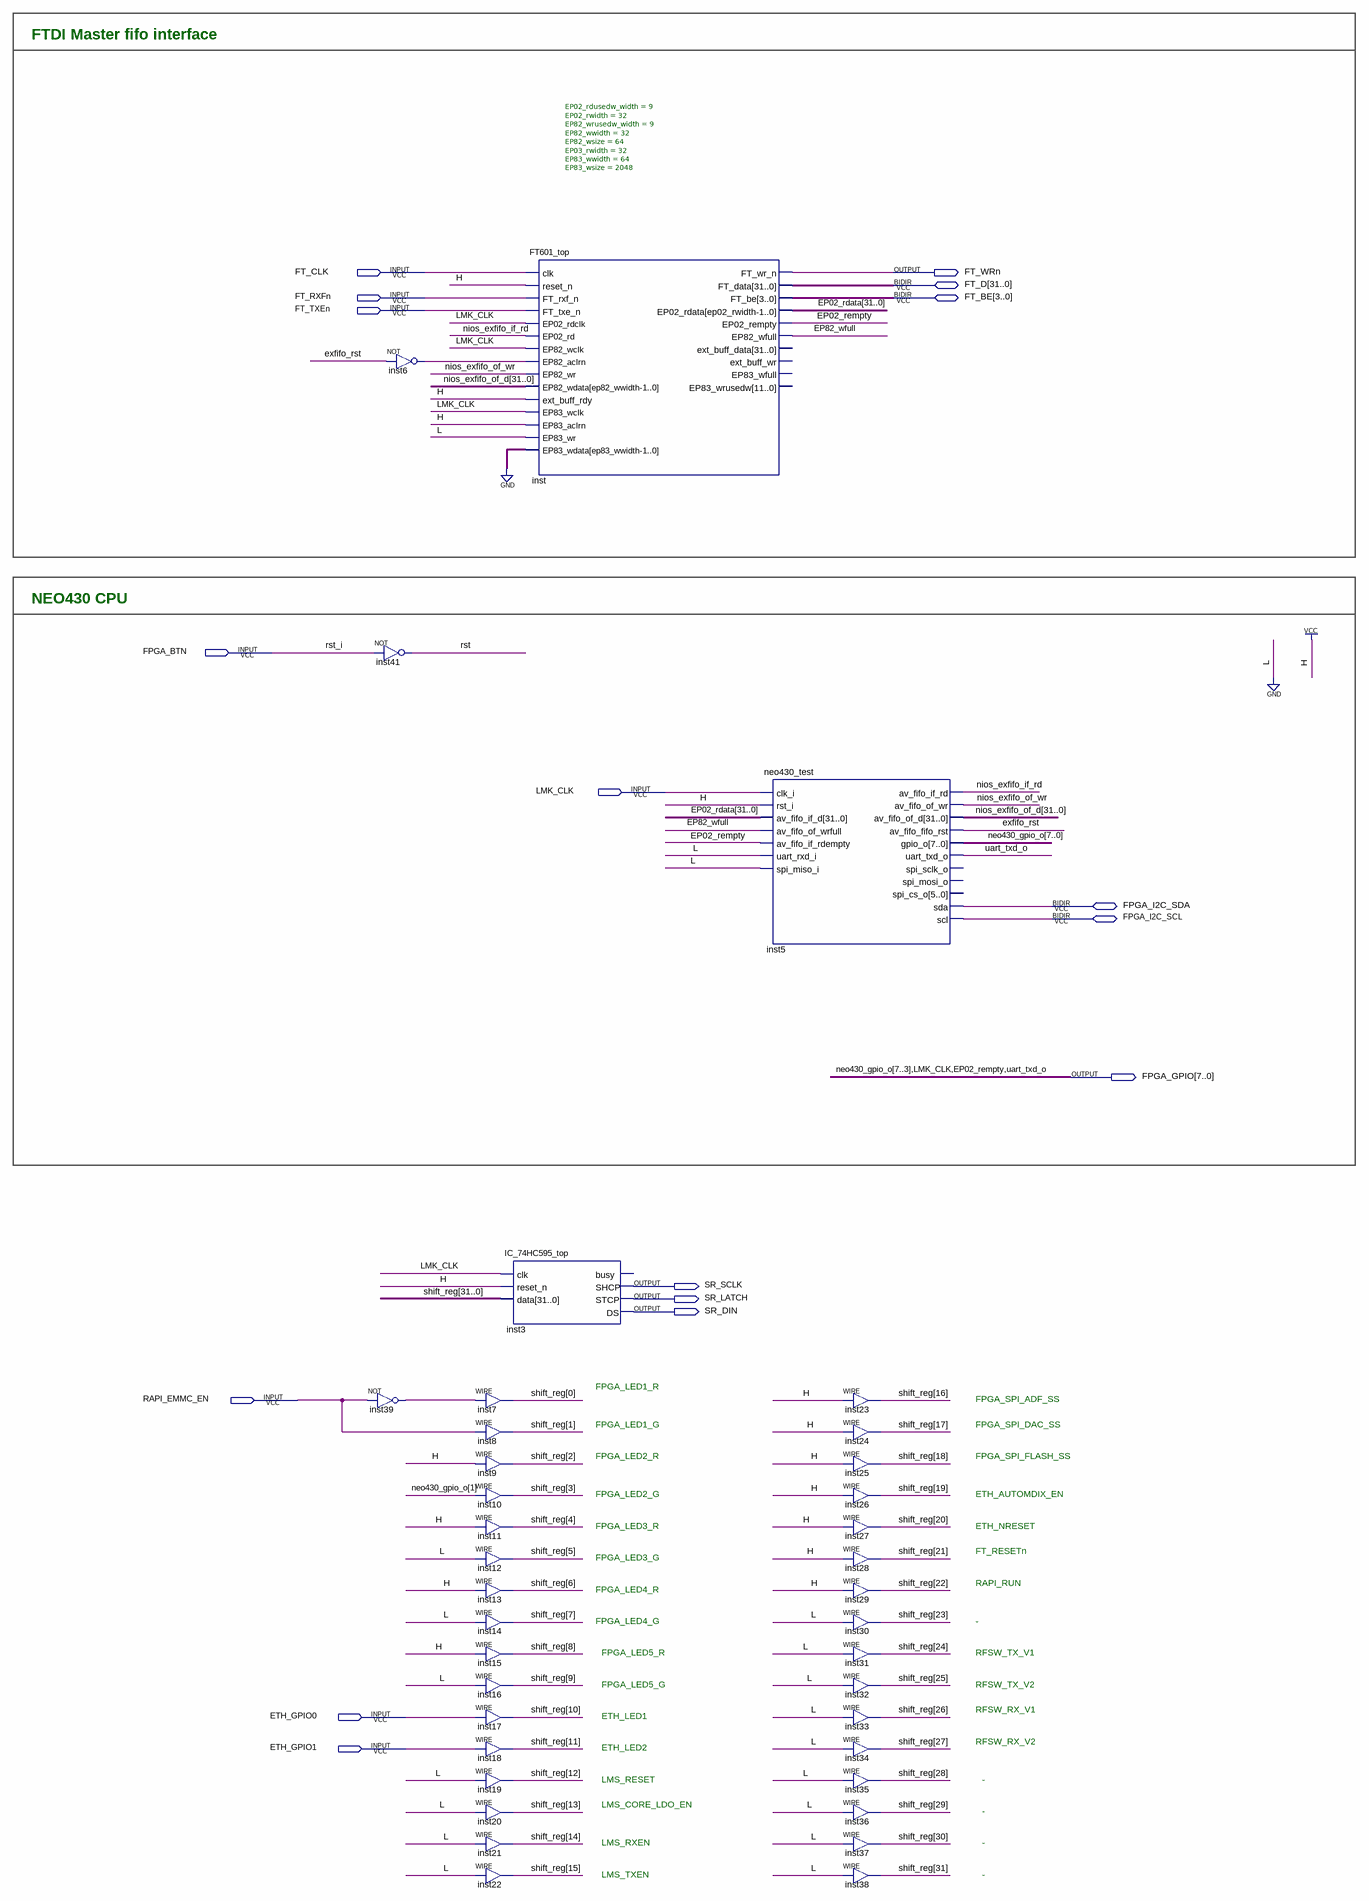
[diagram p0: schematic sheet]
// Quartus schematic factory_top.bdf as structural Verilog: 38 symbols, 17 pins
module factory_top (
  input  FT_CLK,
  input  FT_RXFn,
  input  FT_TXEn,
  input  FPGA_BTN,
  input  LMK_CLK,
  input  RAPI_EMMC_EN,
  input  ETH_GPIO0,
  input  ETH_GPIO1,
  inout  [31:0] FT_D,
  inout  [3:0] FT_BE,
  inout  FPGA_I2C_SDA,
  inout  FPGA_I2C_SCL,
  output FT_WRn,
  output [7:0] FPGA_GPIO,
  output SR_SCLK,
  output SR_LATCH,
  output SR_DIN
);

  wire EP82_wfull, exfifo_rst, inst6_out, inst39_out, nios_exfifo_if_rd, nios_exfifo_of_wr, rst;
  wire [2:0] neo430_gpio_o;
  wire [31:0] EP02_rdata, nios_exfifo_of_d, shift_reg;

  not inst6 (inst6_out, exfifo_rst);
  not inst41 (rst, FPGA_BTN);
  not inst39 (inst39_out, RAPI_EMMC_EN);
  assign shift_reg[0] = inst39_out;  // WIRE inst7
  assign shift_reg[1] = RAPI_EMMC_EN;  // WIRE inst8
  assign shift_reg[2] = 1'b1;  // WIRE inst9
  assign shift_reg[3] = neo430_gpio_o[1];  // WIRE inst10
  assign shift_reg[4] = 1'b1;  // WIRE inst11
  assign shift_reg[5] = 1'b0;  // WIRE inst12
  assign shift_reg[6] = 1'b1;  // WIRE inst13
  assign shift_reg[7] = 1'b0;  // WIRE inst14
  assign shift_reg[8] = 1'b1;  // WIRE inst15
  assign shift_reg[9] = 1'b0;  // WIRE inst16
  assign shift_reg[10] = ETH_GPIO0;  // WIRE inst17
  assign shift_reg[11] = ETH_GPIO1;  // WIRE inst18
  assign shift_reg[12] = 1'b0;  // WIRE inst19
  assign shift_reg[13] = 1'b0;  // WIRE inst20
  assign shift_reg[14] = 1'b0;  // WIRE inst21
  assign shift_reg[15] = 1'b0;  // WIRE inst22
  FT601_top #(.EP02_rdusedw_width(9), .EP02_rwidth(32), .EP82_wrusedw_width(9), .EP82_wwidth(32), .EP82_wsize(64), .EP03_rwidth(32), .EP83_wwidth(64), .EP83_wsize(2048)) inst (
    .clk(FT_CLK), .reset_n(1'b1), .FT_rxf_n(FT_RXFn), .FT_txe_n(FT_TXEn), .EP02_rdclk(LMK_CLK),
    .EP02_rd(nios_exfifo_if_rd), .EP82_wclk(LMK_CLK), .EP82_aclrn(inst6_out), .EP82_wr(nios_exfifo_of_wr),
    .EP82_wdata(nios_exfifo_of_d), .ext_buff_rdy(1'b1), .EP83_wclk(LMK_CLK), .EP83_aclrn(1'b1),
    .EP83_wr(1'b0), .EP83_wdata({64{1'b0}}), .FT_wr_n(FT_WRn), .EP02_rdata(EP02_rdata),
    .EP02_rempty(FPGA_GPIO[1]), .EP82_wfull(EP82_wfull), .FT_data(FT_D), .FT_be(FT_BE));  // open: ext_buff_data, ext_buff_wr, EP83_wfull, EP83_wrusedw
  IC_74HC595_top inst3 (
    .clk(LMK_CLK), .reset_n(1'b1), .data(shift_reg), .SHCP(SR_SCLK), .STCP(SR_LATCH), .DS(SR_DIN));  // open: busy
  neo430_test inst5 (
    .clk_i(LMK_CLK), .rst_i(1'b1), .av_fifo_if_d(EP02_rdata), .av_fifo_of_wrfull(EP82_wfull),
    .av_fifo_if_rdempty(FPGA_GPIO[1]), .uart_rxd_i(1'b0), .spi_miso_i(1'b0),
    .av_fifo_if_rd(nios_exfifo_if_rd), .av_fifo_of_wr(nios_exfifo_of_wr), .av_fifo_of_d(nios_exfifo_of_d),
    .av_fifo_fifo_rst(exfifo_rst), .gpio_o({FPGA_GPIO[7:3], neo430_gpio_o}), .uart_txd_o(FPGA_GPIO[0]),
    .sda(FPGA_I2C_SDA), .scl(FPGA_I2C_SCL));  // open: spi_sclk_o, spi_mosi_o, spi_cs_o
  assign shift_reg[16] = 1'b1;  // WIRE inst23
  assign shift_reg[17] = 1'b1;  // WIRE inst24
  assign shift_reg[18] = 1'b1;  // WIRE inst25
  assign shift_reg[19] = 1'b1;  // WIRE inst26
  assign shift_reg[20] = 1'b1;  // WIRE inst27
  assign shift_reg[21] = 1'b1;  // WIRE inst28
  assign shift_reg[22] = 1'b1;  // WIRE inst29
  assign shift_reg[23] = 1'b0;  // WIRE inst30
  assign shift_reg[24] = 1'b0;  // WIRE inst31
  assign shift_reg[25] = 1'b0;  // WIRE inst32
  assign shift_reg[26] = 1'b0;  // WIRE inst33
  assign shift_reg[27] = 1'b0;  // WIRE inst34
  assign shift_reg[28] = 1'b0;  // WIRE inst35
  assign shift_reg[29] = 1'b0;  // WIRE inst36
  assign shift_reg[30] = 1'b0;  // WIRE inst37
  assign shift_reg[31] = 1'b0;  // WIRE inst38

  assign FPGA_GPIO[2] = LMK_CLK;

  // Other names for the same wires on the sheet: EP02_rempty = FPGA_GPIO[1]; neo430_gpio_o[7:3] = FPGA_GPIO[7:3];
  //   rst_i = FPGA_BTN; uart_txd_o = FPGA_GPIO[0]

  // Notes on the sheet:
  //   FTDI Master fifo interface
  //   NEO430 CPU
  //   FPGA_LED1_R
  //   FPGA_SPI_ADF_SS
  //   FPGA_LED1_G
  //   FPGA_SPI_DAC_SS
  //   FPGA_LED2_R
  //   FPGA_SPI_FLASH_SS
  //   FPGA_LED2_G
  //   ETH_AUTOMDIX_EN
  //   FPGA_LED3_R
  //   ETH_NRESET
  //   FT_RESETn
  //   FPGA_LED3_G
  //   RAPI_RUN
  //   FPGA_LED4_R
  //   FPGA_LED4_G
  //   -
  //   FPGA_LED5_R 
  //   RFSW_TX_V1
  //   FPGA_LED5_G 
  //   RFSW_TX_V2
  //   RFSW_RX_V1
  //   ETH_LED1
  //   RFSW_RX_V2
  //   ETH_LED2
  //   LMS_RESET
  //   -
  //   LMS_CORE_LDO_EN
  //   -
  //   LMS_RXEN
  //   -
  //   LMS_TXEN
  //   -
endmodule
